# EAGLE design mirrored (EAGLE 9.1.2)
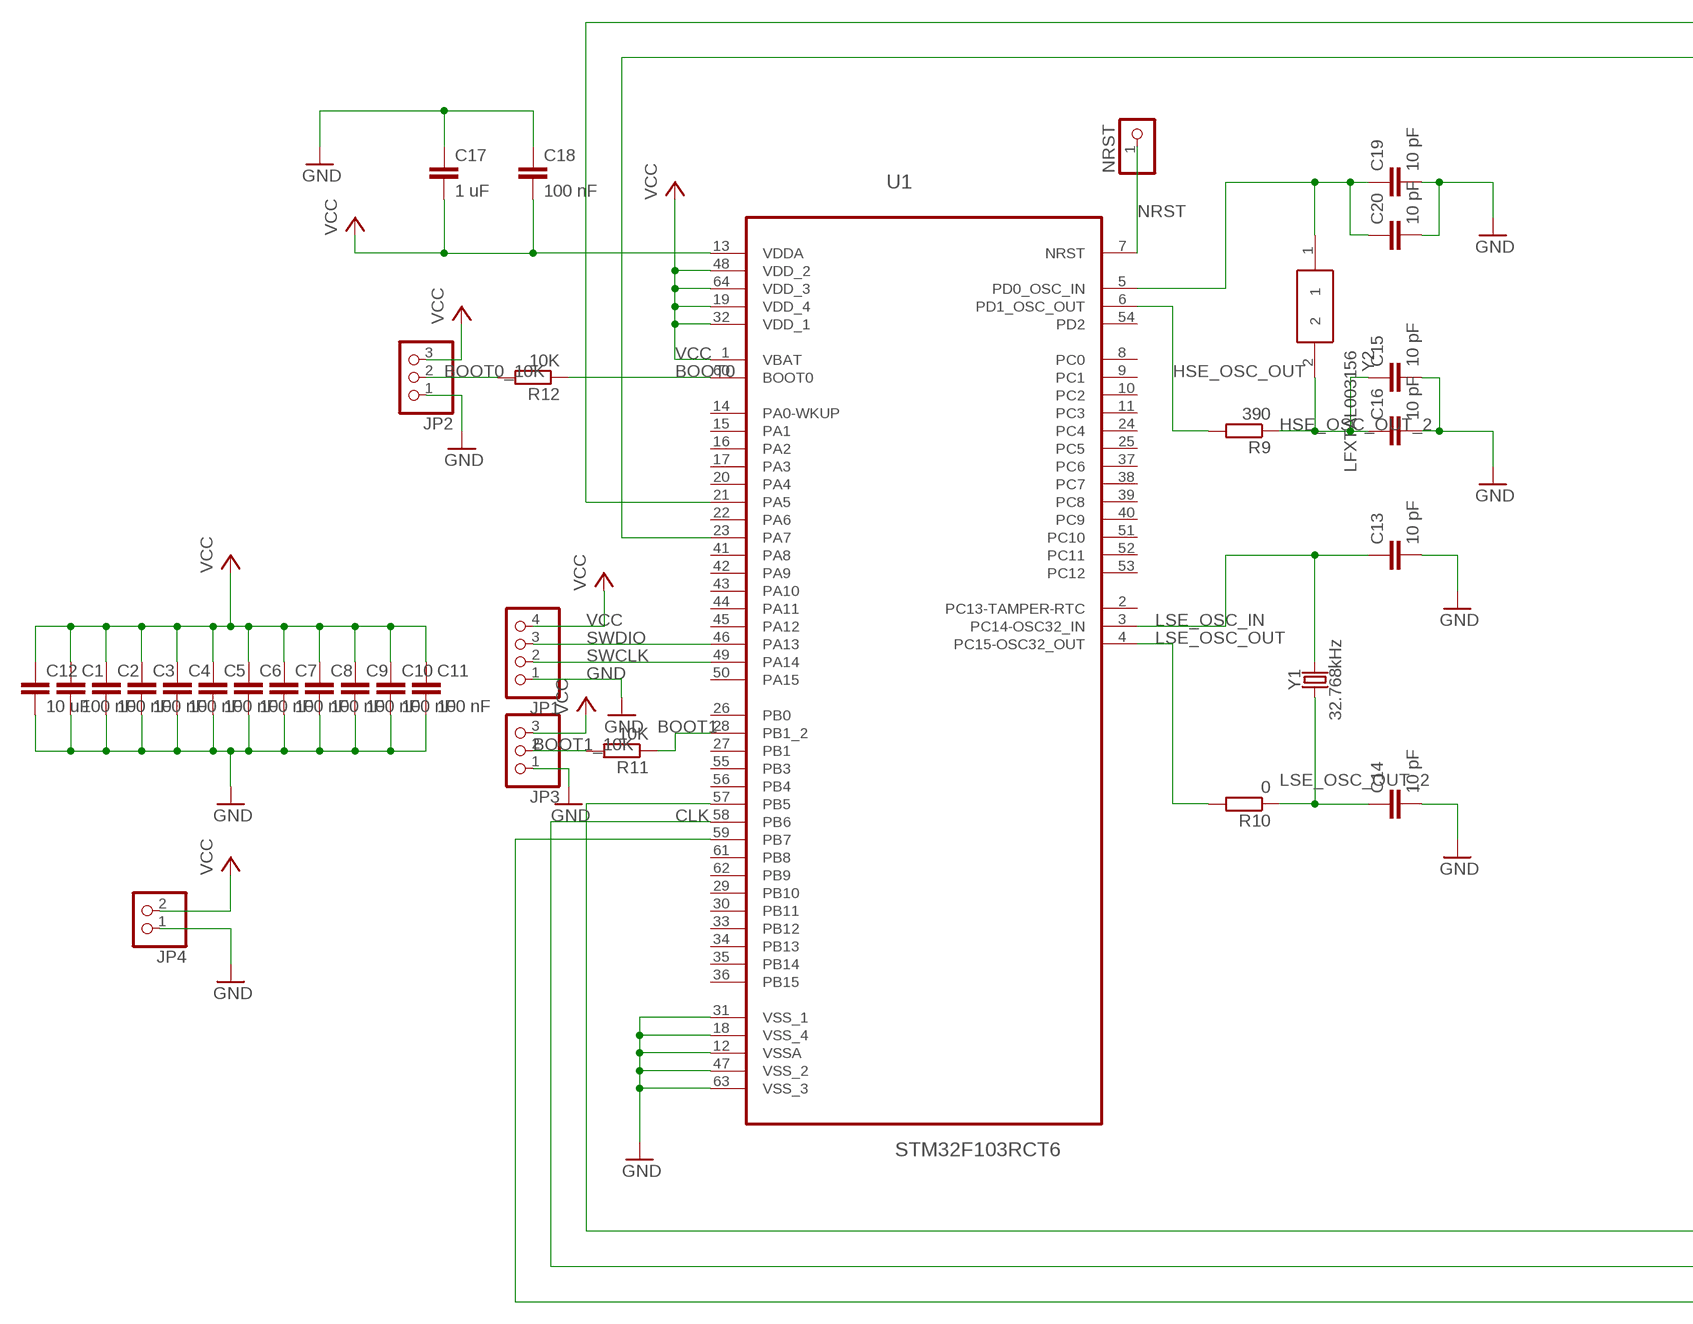
[diagram p0: schematic, sheet 1, part 1 of 2]
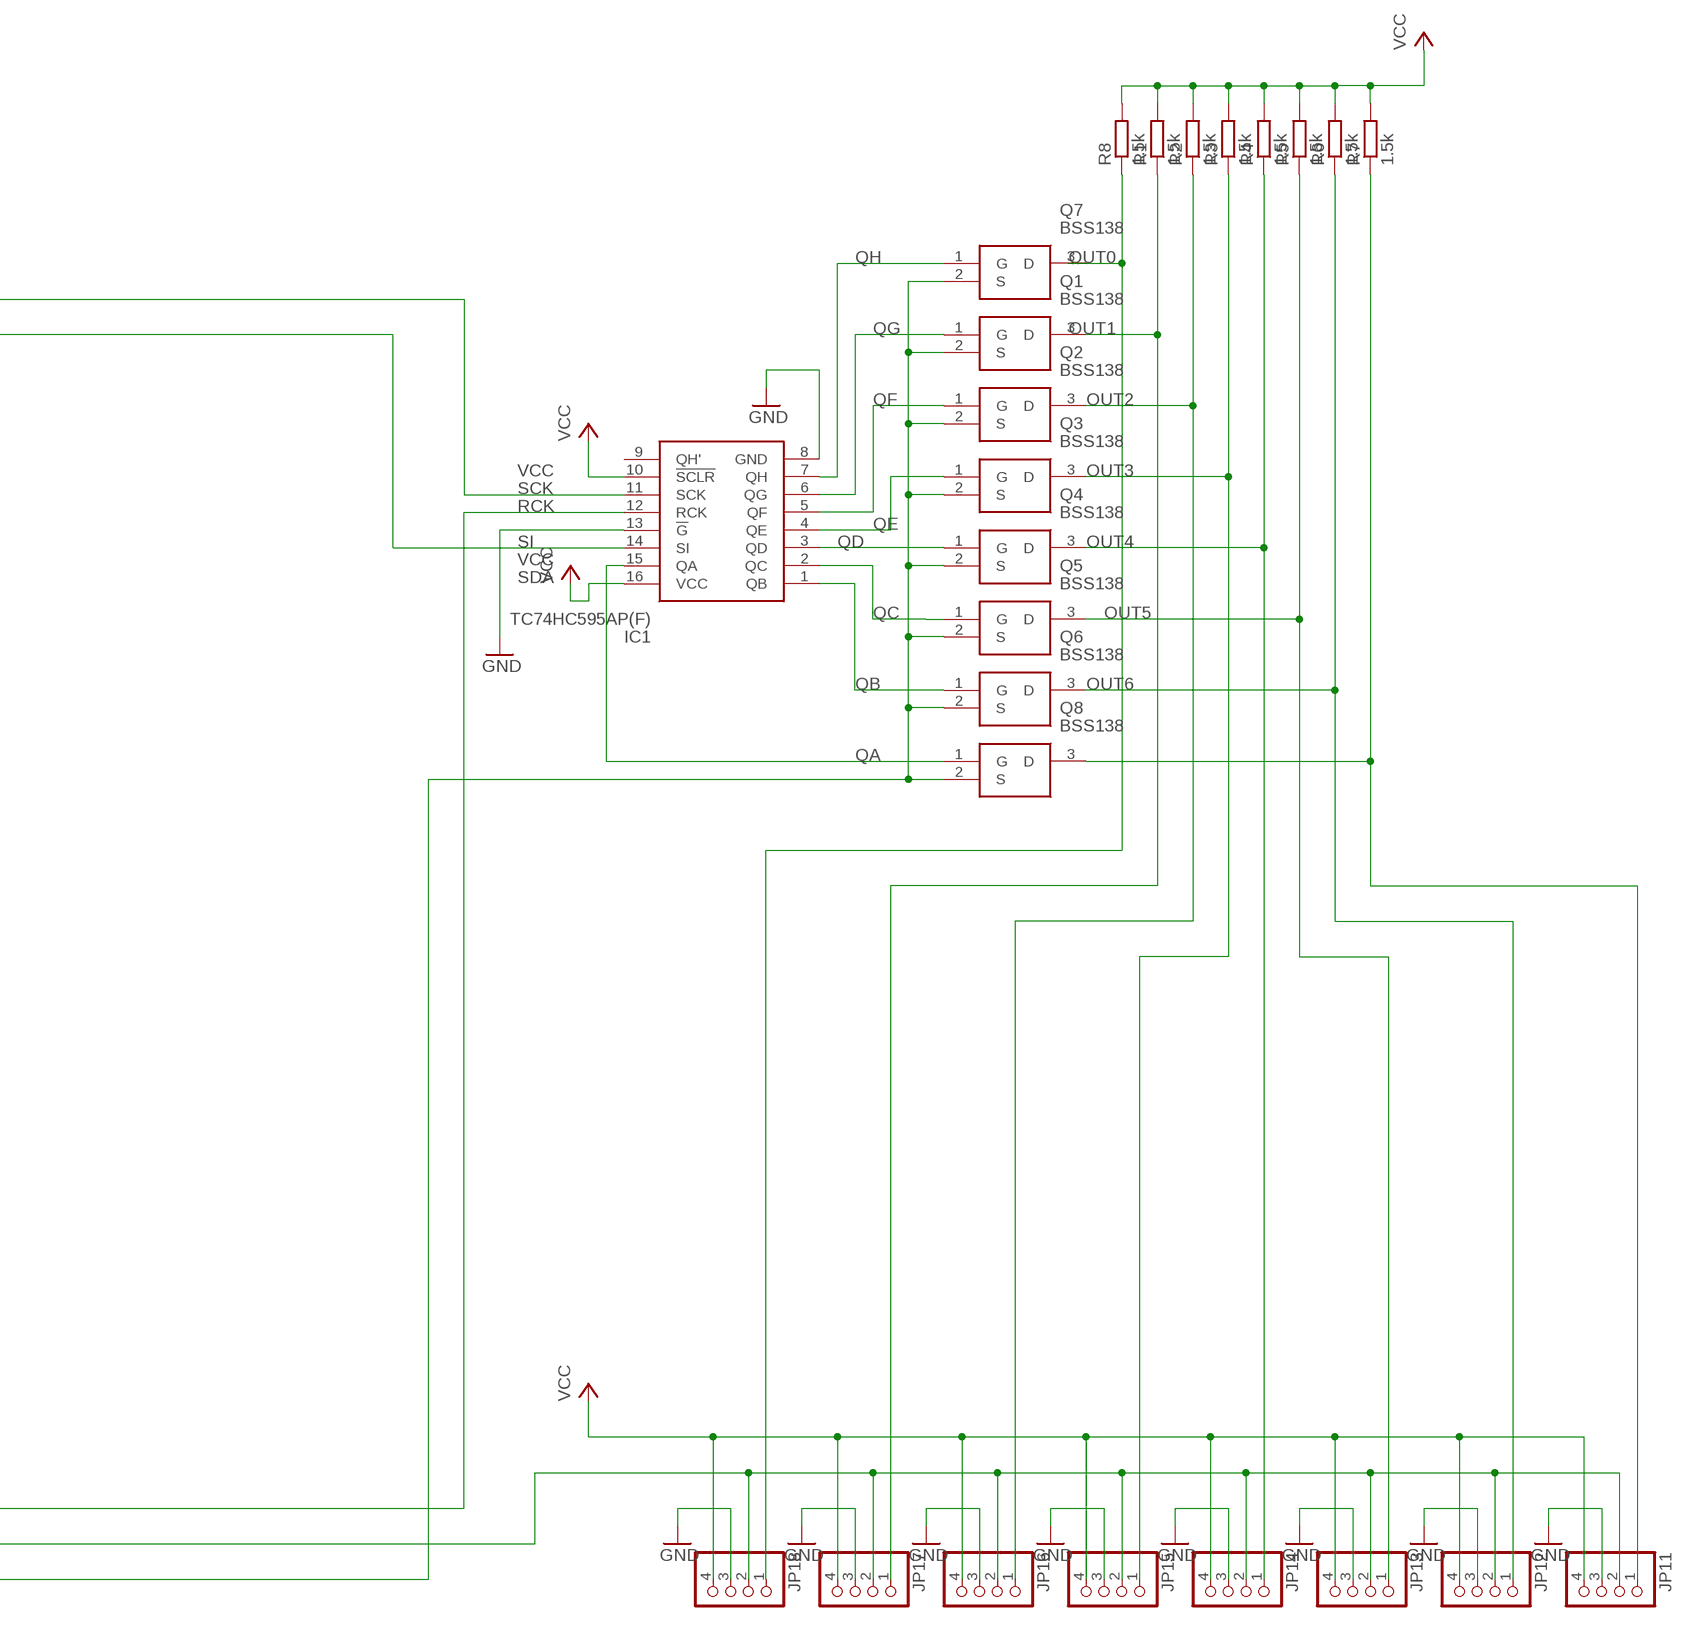
[diagram p1: schematic, sheet 1, part 2 of 2]

## Parts
C1  100 nF  C-EUC0603  [C0603]
C2  100 nF  C-EUC0603  [C0603]
C3  100 nF  C-EUC0603  [C0603]
C4  100 nF  C-EUC0603  [C0603]
C5  100 nF  C-EUC0603  [C0603]
C6  100 nF  C-EUC0603  [C0603]
C7  100 nF  C-EUC0603  [C0603]
C8  100 nF  C-EUC0603  [C0603]
C9  100 nF  C-EUC0603  [C0603]
C10  100 nF  C-EUC0603  [C0603]
C11  100 nF  C-EUC0603  [C0603]
C12  10 uF  C-EUC0603  [C0603]
C13  10 pF  C-EUC0805  [C0805]
C14  10 pF  C-EUC0805  [C0805]
C15  10 pF  C-EUC0805  [C0805]
C16  10 pF  C-EUC0805  [C0805]
C17  1 uF  C-EUC0603  [C0603]
C18  100 nF  C-EUC0603  [C0603]
C19  10 pF  C-EUC0805  [C0805]
C20  10 pF  C-EUC0805  [C0805]
IC1  TC74HC595AP(F)  [DIP762W60P254L1925H445Q16N]
JP1  PINHD-1X4  [1X04]
JP2  PINHD-1X3  [1X03]
JP3  PINHD-1X3  [1X03]
JP4  PINHD-1X2  [1X02]
JP11  PINHD-1X4  [1X04]
JP12  PINHD-1X4  [1X04]
JP13  PINHD-1X4  [1X04]
JP14  PINHD-1X4  [1X04]
JP15  PINHD-1X4  [1X04]
JP16  PINHD-1X4  [1X04]
JP17  PINHD-1X4  [1X04]
JP18  PINHD-1X4  [1X04]
NRST  PINHD-1X1  [1X01]
Q1  BSS138  [SOT95P240X120-3N]
Q2  BSS138  [SOT95P240X120-3N]
Q3  BSS138  [SOT95P240X120-3N]
Q4  BSS138  [SOT95P240X120-3N]
Q5  BSS138  [SOT95P240X120-3N]
Q6  BSS138  [SOT95P240X120-3N]
Q7  BSS138  [SOT95P240X120-3N]
Q8  BSS138  [SOT95P240X120-3N]
R1  1.5k  R-EU_0207/15  [0207/15]
R2  1.5k  R-EU_0207/15  [0207/15]
R3  1.5k  R-EU_0207/15  [0207/15]
R4  1.5k  R-EU_0207/15  [0207/15]
R5  1.5k  R-EU_0207/15  [0207/15]
R6  1.5k  R-EU_0207/15  [0207/15]
R7  1.5k  R-EU_0207/15  [0207/15]
R8  1.5k  R-EU_0207/15  [0207/15]
R9  390  R-EU_0207/15  [0207/15]
R10  0  R-EU_0207/15  [0207/15]
R11  10K  R-EU_0207/15  [0207/15]
R12  10K  R-EU_0207/15  [0207/15]
U1  STM32F103RCT6  [QFP50P1200X1200X160-64N]
Y1  32.768kHz  CRYSTAL-32.768KHZPTH-2X6  [CRYSTAL-PTH-2X6-CYL]
Y2  LFXTAL003156  [IQD-HC-49-4H]

## Nets
BOOT0: R12.1 U1.60(BOOT0)
BOOT0_10K: JP2.2 R12.2
BOOT1: R11.1 U1.28(PB1_2)
BOOT1_10K: JP3.2 R11.2
CLK: JP11.2 JP12.2 JP13.2 JP14.2 JP15.2 JP16.2 JP17.2 JP18.2 U1.58(PB6)
GND: C1.2 C2.2 C3.2 C4.2 C5.2 C6.2 C7.2 C8.2 C9.2 C10.2 C11.2 C12.2 C13.2 C14.2 C15.2 C16.2 C17.1 C18.1 C19.2 C20.2 IC1.8(GND) IC1.13(!G) JP1.1 JP2.1 JP3.1 JP4.1 JP11.3 JP12.3 JP13.3 JP14.3 JP15.3 JP16.3 JP17.3 JP18.3 U1.12(VSSA) U1.18(VSS_4) U1.31(VSS_1) U1.47(VSS_2) U1.63(VSS_3)
HSE_OSC_IN: C19.1 C20.1 U1.5(PD0_OSC_IN) Y2.1
HSE_OSC_OUT: R9.2 U1.6(PD1_OSC_OUT)
HSE_OSC_OUT_2: C15.1 C16.1 R9.1 Y2.2
LSE_OSC_IN: C13.1 U1.3(PC14-OSC32_IN) Y1.2
LSE_OSC_OUT: R10.2 U1.4(PC15-OSC32_OUT)
LSE_OSC_OUT_2: C14.1 R10.1 Y1.1
NRST: NRST.1 U1.7(NRST)
OUT0: JP18.1 Q7.3(D) R8.1
OUT1: JP17.1 Q1.3(D) R1.1
OUT2: JP16.1 Q2.3(D) R2.1
OUT3: JP15.1 Q3.3(D) R3.1
OUT4: JP14.1 Q4.3(D) R4.1
OUT5: JP13.1 Q5.3(D) R5.1
OUT6: JP12.1 Q6.3(D) R6.1
OUT7: JP11.1 Q8.3(D) R7.1
QA: IC1.15(QA) Q8.1(G)
QB: IC1.1(QB) Q6.1(G)
QC: IC1.2(QC) Q5.1(G)
QD: IC1.3(QD) Q4.1(G)
QE: IC1.4(QE) Q3.1(G)
QF: IC1.5(QF) Q2.1(G)
QG: IC1.6(QG) Q1.1(G)
QH: IC1.7(QH) Q7.1(G)
RCK: IC1.12(RCK) U1.57(PB5)
SCK: IC1.11(SCK) U1.21(PA5)
SDA: Q1.2(S) Q2.2(S) Q3.2(S) Q4.2(S) Q5.2(S) Q6.2(S) Q7.2(S) Q8.2(S) U1.59(PB7)
SI: IC1.14(SI) U1.23(PA7)
SWCLK: JP1.2 U1.49(PA14)
SWDIO: JP1.3 U1.46(PA13)
VCC: C1.1 C2.1 C3.1 C4.1 C5.1 C6.1 C7.1 C8.1 C9.1 C10.1 C11.1 C12.1 C17.2 C18.2 IC1.10(!SCLR) IC1.16(VCC) JP1.4 JP2.3 JP3.3 JP4.2 JP11.4 JP12.4 JP13.4 JP14.4 JP15.4 JP16.4 JP17.4 JP18.4 R1.2 R2.2 R3.2 R4.2 R5.2 R6.2 R7.2 R8.2 U1.1(VBAT) U1.13(VDDA) U1.19(VDD_4) U1.32(VDD_1) U1.48(VDD_2) U1.64(VDD_3)
Unconnected: IC1.9(QH') U1.2(PC13-TAMPER-RTC) U1.8(PC0) U1.9(PC1) U1.10(PC2) U1.11(PC3) U1.14(PA0-WKUP) U1.15(PA1) U1.16(PA2) U1.17(PA3) U1.20(PA4) U1.22(PA6) U1.24(PC4) U1.25(PC5) U1.26(PB0) U1.27(PB1) U1.29(PB10) U1.30(PB11) U1.33(PB12) U1.34(PB13) U1.35(PB14) U1.36(PB15) U1.37(PC6) U1.38(PC7) U1.39(PC8) U1.40(PC9) U1.41(PA8) U1.42(PA9) U1.43(PA10) U1.44(PA11) U1.45(PA12) U1.50(PA15) U1.51(PC10) U1.52(PC11) U1.53(PC12) U1.54(PD2) U1.55(PB3) U1.56(PB4) U1.61(PB8) U1.62(PB9)

## Library data of the parts
C1-C11 C17 C18 = rcl:C-EU: CAPACITOR, European symbol; SPICEPREFIX: C
C12-C16 C19 C20 = resistor:C-EU: CAPACITOR, European symbol
IC1 = TC74HC595AP(F):TC74HC595AP(F): IC,CMOS logic,DIP16,SHIFT REGISTERS Source: Datasheet <http://toshiba.semicon-storage.com/info/docget.jsp?did=16512&prodName=TC74HC595AP>; DESCRIPTION: IC,CMOS logic,DIP16,SHIFT REGISTERS; HEIGHT: 4.45mm; MANUFACTURER_NAME: Toshiba; MANUFACTURER_PART_NUMBER: TC74HC595AP(F); MOUSER_PART_NUMBER: N/A; MOUSER_PRICE-STOCK: https://www.mouser.com/Search/Refine.aspx?Keyword=N%2FA; RS_PART_NUMBER: 5400095P; RS_PRICE-STOCK: http://au.rs-online.com/web/p/products/5400095P
JP1 JP11-JP18 = pinhead:PINHD-1X4: PIN HEADER
JP2 JP3 = pinhead:PINHD-1X3: PIN HEADER
JP4 = pinhead:PINHD-1X2: PIN HEADER
NRST = pinhead:PINHD-1X1: PIN HEADER
Q1-Q8 = BSS138:BSS138: N-channel MOSFET,BSS138 0.2A 50V Source: Datasheet <https://www.onsemi.com/pub/Collateral/BSS138-D.PDF>; DESCRIPTION: N-channel MOSFET,BSS138 0.2A 50V; HEIGHT: 1.2mm; MANUFACTURER_NAME: ON Semiconductor; MANUFACTURER_PART_NUMBER: BSS138; MOUSER_PART_NUMBER: 512-BSS138; RS_PART_NUMBER: 1241694; RS_PRICE-STOCK: http://uk.rs-online.com/web/p/products/1241694
R1-R12 = rcl:R-EU_: RESISTOR, European symbol; SPICEPREFIX: R
U1 = STM32F103RCT6:STM32F103RCT6: ARM-based 32-bit MCU; AVAILABILITY: Unavailable; DESCRIPTION: Mainstream Performance line, ARM Cortex-M3 MCU with 256 Kbytes Flash, 72 MHz CPU, motor control, USB and CAN; MF: STMicroelectronics; MP: STM32F103RCT6; PACKAGE: LQFP-64 STMicroelectronics; PRICE: None
Y1 = SparkFun-Clocks:CRYSTAL-32.768KHZ: 32.768kHz Crystal Frequency: 32.768kHz Frequency Stability: ±20ppm Load Capacitance: 12.5pF (PTH-2X6 & SMD-3.2X1.5), 6pF (SMD-2X6) SparkFun Products: SparkFun BigTime Watch Kit <https://www.sparkfun.com/products/11734> SparkFun nRF52832 Breakout <https://www.sparkfun.com/products/13990> SparkFun Real Time Clock Module <https://www.sparkfun.com/products/12708>; PROD_ID: XTAL-10112
Y2 = LFXTAL003156:LFXTAL003156: Crystal,8.0000MHz,30ppm,30pF,HC49/4H,XTAL003156 8MHZ Source: Datasheet <https://docs-emea.rs-online.com/webdocs/00af/0900766b800afdaf.pdf>; ALLIED_NUMBER: R1047051; ALLIED_PRICE-STOCK: https://www.alliedelec.com/iqd-frequency-products-lfxtal003156/R1047051/; DESCRIPTION: Crystal,8.0000MHz,30ppm,30pF,HC49/4H,XTAL003156 8MHZ; HEIGHT: mm; MANUFACTURER_NAME: IQD; MANUFACTURER_PART_NUMBER: LFXTAL003156; RS_PART_NUMBER: 1533666; RS_PRICE-STOCK: http://uk.rs-online.com/web/p/products/1533666

## Net classes
0 default: clearance 0.25 mm

## Board
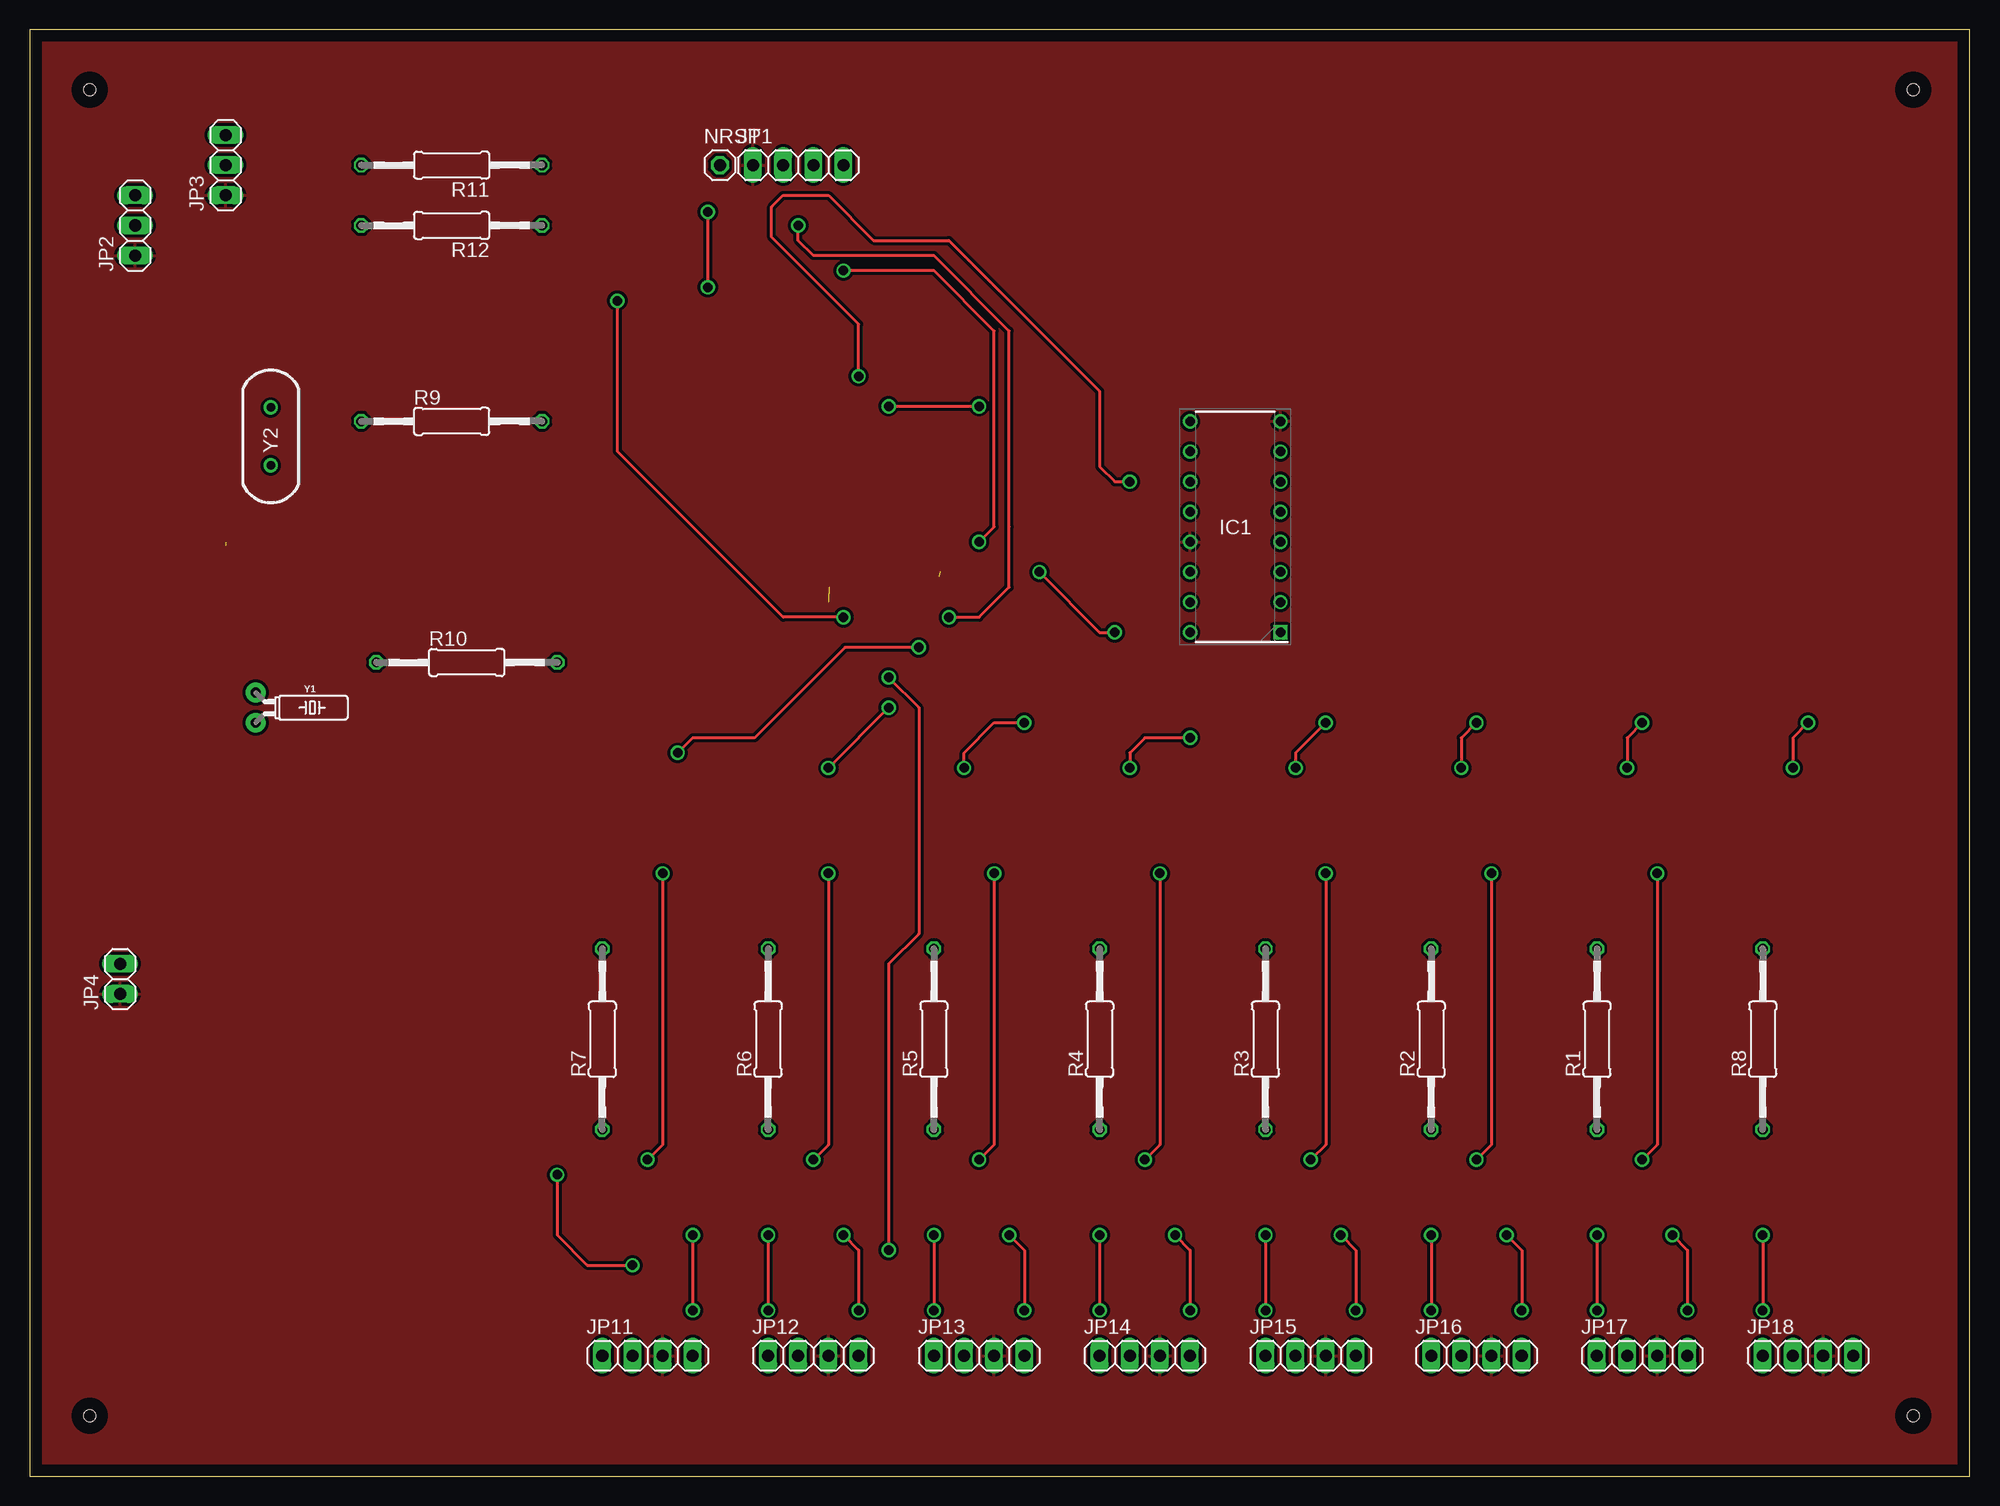
[diagram p2: board, top side]
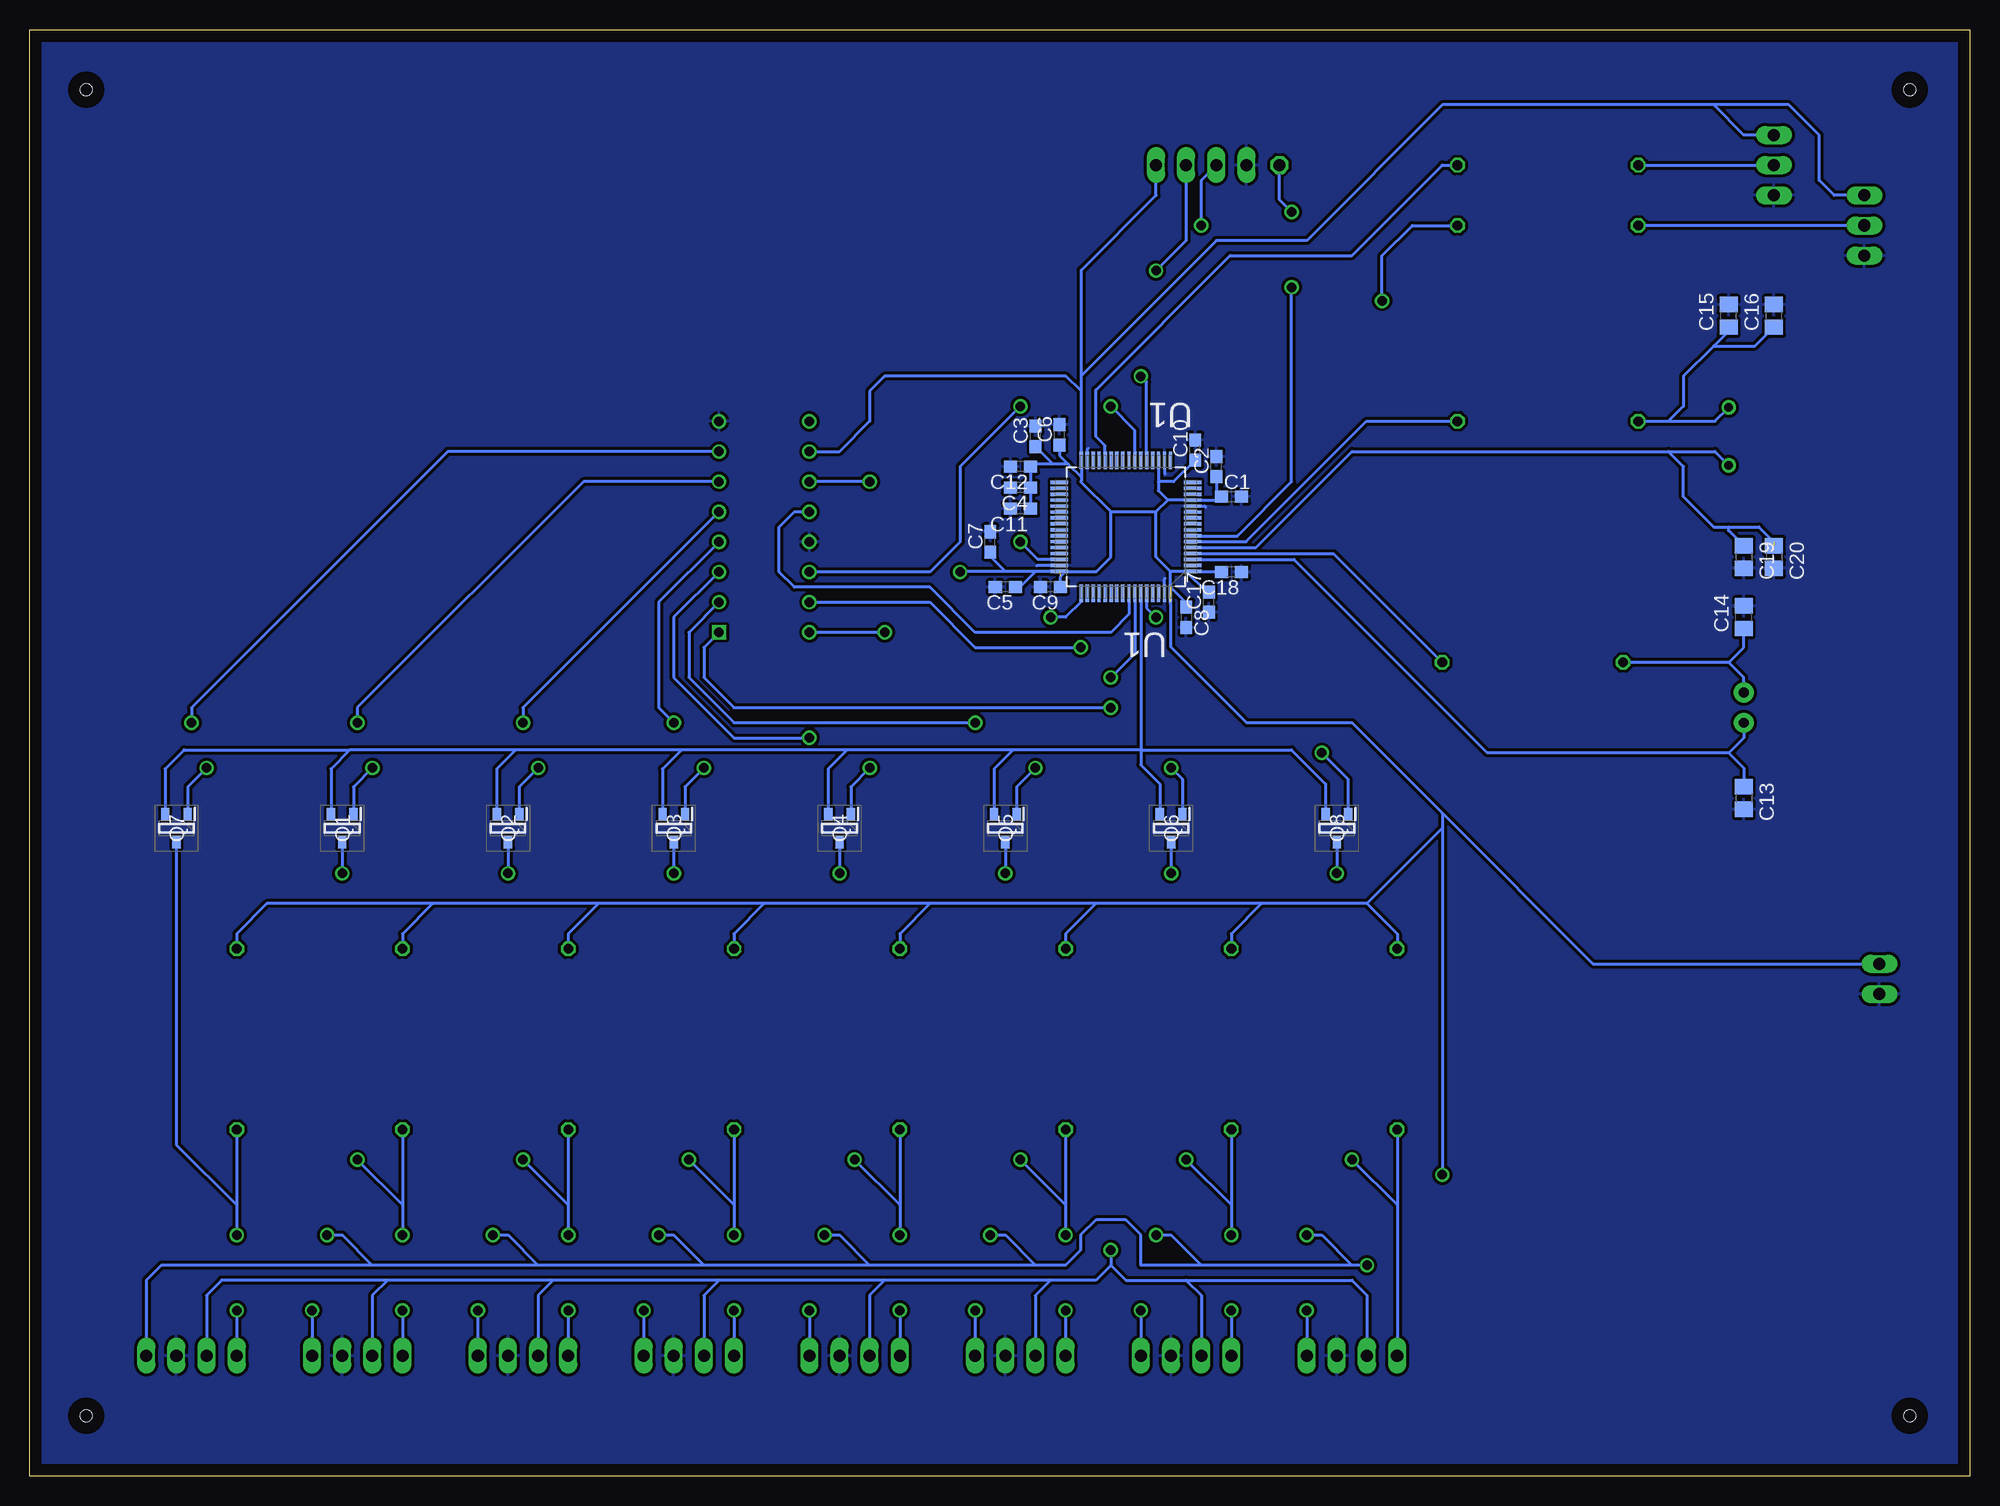
[diagram p3: board, bottom side, seen from below]

Size 163.5 x 121.91 mm. Coordinates in mm from the lower left corner, seen from the top.
Outline: 0,0 163.5,0 163.5,121.91 0,121.91 0,0
Copper layers (1*16): Top 0.035mm / dielectric 1.5mm / Bottom 0.035mm
Design rules "untitled": minimum track width 6mil, minimum drill 0.35mm, track to track 6mil, track to pad 0.152mm, pad to pad 0.152mm, via to via 0.152mm, smd to smd 0.05mm, copper to edge 40mil, drill to drill 6mil, minimum pad ring 0.15mm, minimum via ring 0.15mm, stop-mask expansion 4mil, vias tented up to drill 0mil, thermal gap 10mil
Holes 1 mm at 5.08,116.84 5.08,5.08 158.75,5.08 158.75,116.84

### Footprints (pad centres in the part's own frame; a part is rotated, then mirrored left to right if it is on the bottom)
C0603 = smd 1.1 x 1: 1 -0.85,0; 2 0.85,0
C0805 = smd 1.3 x 1.5: 1 -0.95,0; 2 0.95,0
DIP762W60P254L1925H445Q16N = drill 0.8 pad 1.2 square: 1 -3.81,8.89 | drill 0.8 pad 1.2: 2 -3.81,6.35; 3 -3.81,3.81; 4 -3.81,1.27; 5 -3.81,-1.27; 6 -3.81,-3.81; 7 -3.81,-6.35; 8 -3.81,-8.89; 9 3.81,-8.89; 10 3.81,-6.35; 11 3.81,-3.81; 12 3.81,-1.27; 13 3.81,1.27; 14 3.81,3.81; 15 3.81,6.35; 16 3.81,8.89
1X04 = drill 1.016 long: 1 -3.81,0; 2 -1.27,0; 3 1.27,0; 4 3.81,0
1X03 = drill 1.016 long: 1 -2.54,0; 2 0,0; 3 2.54,0
1X02 = drill 1.016 long: 1 -1.27,0; 2 1.27,0
1X01 = drill 1.016 octagon: 1 0,0
SOT95P240X120-3N = smd 1 x 0.7: 1 -1.2,0.95; 2 -1.2,-0.95; 3 1.2,0
0207/15 = drill 0.813 octagon: 1 -7.62,0; 2 7.62,0
QFP50P1200X1200X160-64N = smd 1.473 x 0.279: 1 -5.613,3.759; 2 -5.613,3.251; 3 -5.613,2.743; 4 -5.613,2.261; 5 -5.613,1.753; 6 -5.613,1.245; 7 -5.613,0.762; 8 -5.613,0.254; 9 -5.613,-0.254; 10 -5.613,-0.762; 11 -5.613,-1.245; 12 -5.613,-1.753; 13 -5.613,-2.261; 14 -5.613,-2.743; 15 -5.613,-3.251; 16 -5.613,-3.759; 33 5.613,-3.759; 34 5.613,-3.251; 35 5.613,-2.743; 36 5.613,-2.261; 37 5.613,-1.753; 38 5.613,-1.245; 39 5.613,-0.762; 40 5.613,-0.254; 41 5.613,0.254; 42 5.613,0.762; 43 5.613,1.245; 44 5.613,1.753; 45 5.613,2.261; 46 5.613,2.743; 47 5.613,3.251; 48 5.613,3.759 | smd 0.279 x 1.473: 17 -3.759,-5.613; 18 -3.251,-5.613; 19 -2.743,-5.613; 20 -2.261,-5.613; 21 -1.753,-5.613; 22 -1.245,-5.613; 23 -0.762,-5.613; 24 -0.254,-5.613; 25 0.254,-5.613; 26 0.762,-5.613; 27 1.245,-5.613; 28 1.753,-5.613; 29 2.261,-5.613; 30 2.743,-5.613; 31 3.251,-5.613; 32 3.759,-5.613; 49 3.759,5.613; 50 3.251,5.613; 51 2.743,5.613; 52 2.261,5.613; 53 1.753,5.613; 54 1.245,5.613; 55 0.762,5.613; 56 0.254,5.613; 57 -0.254,5.613; 58 -0.762,5.613; 59 -1.245,5.613; 60 -1.753,5.613; 61 -2.261,5.613; 62 -2.743,5.613; 63 -3.251,5.613; 64 -3.759,5.613
CRYSTAL-PTH-2X6-CYL = drill 0.813 pad 1.676: 1 -1.27,0; 2 1.27,0
IQD-HC-49-4H = drill 0.7 pad 1.2: 1 -2.44,0; 2 2.44,0

### Placement (x,y rotation side)
C1  62.23,82.55 0 bottom
C2  63.5,85.09 90 bottom
C3  78.74,87.63 90 bottom
C4  80.01,83.31 180 bottom
C5  81.28,74.93 180 bottom
C6  76.71,87.76 90 bottom
C7  82.55,78.74 90 bottom
C8  66.04,72.39 270 bottom
C9  77.47,74.93 180 bottom
C10  65.28,86.49 90 bottom
C11  80.01,81.53 180 bottom
C12  80.01,85.09 180 bottom
C13  19.05,57.15 270 bottom
C14  19.05,72.39 90 bottom
C15  20.32,97.79 90 bottom
C16  16.51,97.79 90 bottom
C17  64.13,73.66 90 bottom
C18  62.23,76.2 180 bottom
C19  19.05,77.47 270 bottom
C20  16.51,77.47 270 bottom
IC1  101.6,80.01 180 top
JP1  64.77,110.49 0 top
JP2  8.89,105.41 90 top
JP3  16.51,110.49 90 top
JP4  7.62,41.91 90 top
JP11  52.07,10.16 0 top
JP12  66.04,10.16 0 top
JP13  80.01,10.16 0 top
JP14  93.98,10.16 0 top
JP15  107.95,10.16 0 top
JP16  121.92,10.16 0 top
JP17  135.89,10.16 0 top
JP18  149.86,10.16 0 top
NRST  58.17,110.49 0 top
Q1  137.16,54.61 270 bottom
Q2  123.19,54.61 270 bottom
Q3  109.22,54.61 270 bottom
Q4  95.25,54.61 270 bottom
Q5  81.28,54.61 270 bottom
Q6  67.31,54.61 270 bottom
Q7  151.13,54.61 270 bottom
Q8  53.34,54.61 270 bottom
R1  132.08,36.83 90 top
R2  118.11,36.83 90 top
R3  104.14,36.83 90 top
R4  90.17,36.83 90 top
R5  76.2,36.83 90 top
R6  62.23,36.83 90 top
R7  48.26,36.83 90 top
R8  146.05,36.83 90 top
R9  35.56,88.9 0 top
R10  36.83,68.58 0 top
R11  35.56,110.49 180 top
R12  35.56,105.41 180 top
U1  71.12,80.01 180 bottom
Y1  19.05,64.77 270 top
Y2  20.32,87.63 90 top

### Tracks (layer width: path | path; a pad name or v marks a point on that pad's centre or on a via)
BOOT0  (via drill 0.8)
  Top 0.254: v68.58,72.39 63.5,72.39 49.53,86.36 v49.53,99.06
  Bottom 0.254: U1.60 69.37,73.18 v68.58,72.39 | v49.53,99.06 49.53,102.87 46.99,105.41 R12.1
BOOT0_10K
  Bottom 0.254: JP2.2 R12.2
BOOT1
  Bottom 0.254: U1.28 72.87,86.84 73.66,87.63 73.66,91.55 62.34,102.87 52.07,102.87 44.45,110.49 R11.1
BOOT1_10K
  Bottom 0.254: R11.2 JP3.2
CLK  (via drill 0.8)
  Top 0.254: v72.39,67.31 74.93,64.77 74.93,45.72 72.39,43.18 v72.39,19.05
  Bottom 0.254: U1.58 70.36,69.34 v72.39,67.31 | 66.04,16.51 71.12,16.51 72.39,17.78 | JP12.2 64.77,15.24 66.04,16.51 | 66.04,16.51 52.07,16.51 50.8,15.24 JP11.2 | 77.47,16.51 73.66,16.51 72.39,17.78 | 77.47,16.51 78.74,15.24 JP13.2 | 77.47,16.51 91.44,16.51 | 91.44,16.51 92.71,15.24 JP14.2 | 105.41,16.51 106.68,15.24 JP15.2 | 91.44,16.51 105.41,16.51 | 105.41,16.51 119.38,16.51 | 119.38,16.51 120.65,15.24 JP16.2 | 119.38,16.51 133.35,16.51 | 133.35,16.51 134.62,15.24 JP17.2 | 133.35,16.51 147.32,16.51 148.59,15.24 JP18.2 | v72.39,19.05 72.39,17.78
GND
  Bottom 0.254: U1.47 78.56,76.76 78.61,76.71 | U1.31 74.37,86.54 74.3,86.61 | U1.18 67.87,84.51 67.82,84.45 | U1.12 64.49,81.76 64.39,81.66 | U1.63 67.87,75.64 67.82,75.69
  pour Top: -35.56,165.1 -35.56,-3.3 6.86,-45.72 173.99,-45.72 218.44,-1.27 218.44,130.81 179.07,170.18 -30.48,170.18
  pour Bottom: -25.4,162.56 -34.61,153.35 -34.61,2.86 43.18,-74.93 180.34,-74.93 256.54,1.27 256.54,158.75 229.87,185.42 -2.54,185.42
HSE_OSC_IN  (1 unrouted)
  Bottom 0.254: U1.5 60.17,78.26 52.07,86.36 25.4,86.36 | Y2.1 21.49,86.36 25.4,86.36 | 25.4,86.36 24.13,85.09 24.13,82.55 21.59,80.01 20.32,80.01 | 16.51,78.74 17.78,80.01 20.32,80.01 | C19.1 20.32,79.69 20.32,80.01
HSE_OSC_OUT
  Bottom 0.254: U1.6 60.98,78.76 50.85,88.9 R9.2
HSE_OSC_OUT_2
  Bottom 0.254: Y2.2 21.49,88.9 25.4,88.9 | R9.1 25.4,88.9 | 25.4,88.9 24.13,90.17 24.13,92.71 21.59,95.25 | C16.1 18.1,95.25 21.59,95.25 | 21.59,95.25 20.32,96.52 C15.1
LSE_OSC_IN
  Bottom 0.254: U1.3 56.95,77.27 40.64,60.96 20.32,60.96 | Y1.2 19.05,62.23 20.32,60.96 | 20.32,60.96 19.05,59.69 C13.1
LSE_OSC_OUT
  Bottom 0.254: U1.4 53.62,77.75 R10.2
LSE_OSC_OUT_2
  Bottom 0.254: Y1.1 19.05,67.31 20.32,68.58 | 20.32,68.58 19.05,69.85 C14.1 | 20.32,68.58 R10.1
NRST  (via drill 0.8)
  Top 0.254: v57.15,100.2 v57.15,106.55
  Bottom 0.254: U1.7 61.72,79.25 57.15,83.82 v57.15,100.2 | v57.15,106.55 58.17,107.57 NRST.1
OUT0  (via drill 0.8)
  Top 0.254: v146.05,20.32 v146.05,13.97
  Bottom 0.254: R8.1 146.05,22.86 | 146.05,22.86 v146.05,20.32 | v146.05,13.97 JP18.1 | Q7.3 151.13,27.94 146.05,22.86
OUT1  (via drill 0.8)
  Top 0.254: v132.08,20.32 v132.08,13.97 | v137.16,50.8 137.16,27.94 v135.89,26.67
  Bottom 0.254: R1.1 132.08,22.86 | 132.08,22.86 v132.08,20.32 | v132.08,13.97 JP17.1 | Q1.3 v137.16,50.8 | v135.89,26.67 132.08,22.86
OUT2  (via drill 0.8)
  Top 0.254: v118.11,20.32 v118.11,13.97 | v123.19,50.8 123.19,27.94 v121.92,26.67
  Bottom 0.254: R2.1 118.11,22.86 | 118.11,22.86 v118.11,20.32 | v118.11,13.97 JP16.1 | Q2.3 v123.19,50.8 | v121.92,26.67 118.11,22.86
OUT3  (via drill 0.8)
  Top 0.254: v104.14,20.32 v104.14,13.97 | v109.22,50.8 109.22,27.94 v107.95,26.67
  Bottom 0.254: R3.1 104.14,22.86 | 104.14,22.86 v104.14,20.32 | v104.14,13.97 JP15.1 | Q3.3 v109.22,50.8 | v107.95,26.67 104.14,22.86
OUT4  (via drill 0.8)
  Top 0.254: v90.17,20.32 v90.17,13.97 | v95.25,50.8 95.25,27.94 v93.98,26.67
  Bottom 0.254: R4.1 90.17,22.86 | 90.17,22.86 v90.17,20.32 | v90.17,13.97 JP14.1 | Q4.3 v95.25,50.8 | v93.98,26.67 90.17,22.86
OUT5  (via drill 0.8)
  Top 0.254: v76.2,20.32 v76.2,13.97 | v81.28,50.8 81.28,27.94 v80.01,26.67
  Bottom 0.254: R5.1 76.2,22.86 | 76.2,22.86 v76.2,20.32 | v76.2,13.97 JP13.1 | Q5.3 v81.28,50.8 | v80.01,26.67 76.2,22.86
OUT6  (via drill 0.8)
  Top 0.254: v62.23,20.32 v62.23,13.97 | v67.31,50.8 67.31,27.94 v66.04,26.67
  Bottom 0.254: R6.1 62.23,22.86 | 62.23,22.86 v62.23,20.32 | v62.23,13.97 JP12.1 | Q6.3 v67.31,50.8 | v66.04,26.67 62.23,22.86
OUT7  (via drill 0.8)
  Top 0.254: v53.34,50.8 53.34,27.94 v52.07,26.67
  Bottom 0.254: R7.1 48.26,22.86 | 48.26,22.86 JP11.1 | Q8.3 v53.34,50.8 | v52.07,26.67 48.26,22.86
QA  (via drill 0.8)
  Top 0.254: v74.93,69.85 68.7,69.85 61.09,62.23 55.88,62.23 v54.61,60.96
  Bottom 0.254: IC1.15 87.63,73.66 83.82,69.85 v74.93,69.85 | v54.61,60.96 52.39,58.74 Q8.1
QB  (via drill 0.8)
  Top 0.254: v72.39,64.77 v67.31,59.69
  Bottom 0.254: IC1.1 106.68,69.85 106.68,67.31 104.14,64.77 v72.39,64.77 | Q6.1 66.36,58.74 v67.31,59.69
QC  (via drill 0.8)
  Top 0.254: v78.74,59.69 78.74,60.96 81.28,63.5 v83.82,63.5
  Bottom 0.254: IC1.2 107.95,71.12 107.95,67.31 104.14,63.5 v83.82,63.5 | v78.74,59.69 80.33,58.1 Q5.1
QD  (via drill 0.8)
  Top 0.254: v92.71,59.69 92.71,60.96 93.98,62.23 v97.79,62.23
  Bottom 0.254: IC1.3 109.22,72.39 109.22,67.31 104.14,62.23 v97.79,62.23 | Q4.1 94.3,58.1 v92.71,59.69
QE  (via drill 0.8)
  Top 0.254: v109.22,63.5 106.68,60.96 v106.68,59.69
  Bottom 0.254: IC1.4 110.49,73.66 110.49,64.77 v109.22,63.5 | Q3.1 108.27,58.1 v106.68,59.69
QF  (via drill 0.8)
  Top 0.254: v121.92,63.5 120.65,62.23 v120.65,59.69
  Bottom 0.254: IC1.5 121.92,64.77 v121.92,63.5 | v120.65,59.69 122.24,58.1 Q2.1
QG  (via drill 0.8)
  Top 0.254: v135.89,63.5 134.62,62.23 v134.62,59.69
  Bottom 0.254: v135.89,63.5 135.89,64.77 116.84,83.82 IC1.6 | v134.62,59.69 136.21,58.1 Q1.1
QH  (via drill 0.8)
  Top 0.254: v149.86,63.5 148.59,62.23 v148.59,59.69
  Bottom 0.254: IC1.7 128.27,86.36 149.86,64.77 v149.86,63.5 | v148.59,59.69 150.18,58.1 Q7.1
RCK
  Bottom 0.254: U1.57 70.87,72.64 72.39,71.12 83.82,71.12 87.63,74.93 99.06,74.93 100.33,76.2 100.33,80.01 99.06,81.28 IC1.12
SCK  (via drill 0.8)
  Top 0.254: v69.85,92.71 69.85,97.08 62.52,104.4 62.52,106.97 63.5,107.95 67.31,107.95 71.12,104.14 77.47,104.14 90.17,91.44 90.17,85.09 91.44,83.82 v92.71,83.82
  Bottom 0.254: U1.21 69.37,92.23 v69.85,92.71 | v92.71,83.82 IC1.11
SDA
  Bottom 0.254: U1.59 69.85,74.37 69.85,61.21 | 69.85,61.21 80.64,61.21 | 80.64,61.21 82.23,59.62 Q5.2 | Q6.2 68.26,58.35 69.85,59.94 69.85,61.21 | 80.64,61.21 94.61,61.21 | Q4.2 96.2,59.62 94.61,61.21 | 94.61,61.21 108.58,61.21 | 108.58,61.21 110.17,59.62 Q3.2 | 108.58,61.21 122.55,61.21 | 122.55,61.21 135.89,61.21 136.52,61.21 | Q2.2 124.14,59.62 122.55,61.21 | Q7.2 152.08,59.62 150.49,61.21 136.52,61.21 | 69.85,61.21 57.15,61.21 54.29,58.35 Q8.2 | 136.52,61.21 138.11,59.62 Q1.2
SI  (via drill 0.8)
  Top 0.254: v72.39,90.17 v80.01,90.17
  Bottom 0.254: U1.23 70.36,88.14 v72.39,90.17 | v80.01,90.17 85.09,85.09 85.09,78.74 87.63,76.2 IC1.14
SWCLK  (via drill 0.8)
  Top 0.254: v77.47,72.39 80.01,72.39 82.55,74.93 82.55,80.01 | 82.55,80.01 82.55,96.52 76.2,102.87 66.04,102.87 64.77,104.14 v64.77,105.41 | 82.55,80.01
  Bottom 0.254: U1.49 74.88,73.71 76.2,72.39 v77.47,72.39 | v64.77,105.41 64.77,109.22 JP1.2
SWDIO  (via drill 0.8)
  Top 0.254: v68.58,101.6 76.2,101.6 81.28,96.52 81.28,80.01 v80.01,78.74
  Bottom 0.254: U1.46 78.54,77.27 v80.01,78.74 | v68.58,101.6 66.04,104.14 JP1.3
VCC  (via drill 0.8)  (3 unrouted)
  Top 0.254: v55.88,20.32 v55.88,13.97 | v69.85,13.97 69.85,19.05 v68.58,20.32 | v83.82,13.97 83.82,19.05 v82.55,20.32 | v97.79,13.97 97.79,19.05 v96.52,20.32 | v125.73,13.97 125.73,19.05 v124.46,20.32 | v111.76,13.97 111.76,19.05 v110.49,20.32 | v44.45,25.4 44.45,20.32 46.99,17.78 v50.8,17.78 | v139.7,13.97 139.7,19.05 v138.43,20.32 | v85.09,76.2 90.17,71.12 v91.44,71.12
  Bottom 0.254: JP18.4 153.67,16.51 152.4,17.78 134.62,17.78 | v139.7,13.97 JP17.4 | v125.73,13.97 JP16.4 | v111.76,13.97 JP15.4 | v97.79,13.97 JP14.4 | v83.82,13.97 JP13.4 | v69.85,13.97 JP12.4 | v55.88,13.97 JP11.4 | 44.45,55.88 52.07,63.5 60.96,63.5 67.36,69.9 67.36,73.5 67.35,73.5 67.35,73.66 | 59.69,48.26 62.23,45.72 R6.2 | 59.69,48.26 73.66,48.26 | 73.66,48.26 76.2,45.72 R5.2 | 73.66,48.26 87.63,48.26 | 87.63,48.26 90.17,45.72 R4.2 | 87.63,48.26 101.6,48.26 | 101.6,48.26 104.14,45.72 R3.2 | 101.6,48.26 115.57,48.26 | 115.57,48.26 118.11,45.72 R2.2 | 115.57,48.26 129.54,48.26 | 129.54,48.26 132.08,45.72 R1.2 | R8.2 146.05,45.72 143.51,48.26 129.54,48.26 | 50.8,48.26 59.69,48.26 | 50.8,48.26 48.26,45.72 R7.2 | 44.45,54.61 50.8,48.26 | 44.45,55.88 44.45,54.61 | v50.8,17.78 52.07,17.78 | 52.07,17.78 64.77,17.78 | 64.77,17.78 69.85,17.78 69.85,20.32 71.12,21.59 73.66,21.59 74.93,20.32 74.93,19.05 76.2,17.78 78.74,17.78 | 78.74,17.78 92.71,17.78 | 106.68,17.78 120.65,17.78 | 120.65,17.78 134.62,17.78 | IC1.10 95.25,86.36 92.71,88.9 92.71,91.44 91.44,92.71 76.15,92.71 74.88,91.44 | 74.88,91.44 74.88,92.76 | 74.88,92.76 74.88,101.65 68.58,107.95 JP1.4 | 74.88,91.44 U1.32 74.88,84.19 | 78.74,76.25 U1.48 73.61,76.25 72.39,77.47 72.39,81.28 | 78.74,76.25 81.28,76.25 | 81.28,76.25 85.04,76.25 v85.09,76.2 | v91.44,71.12 IC1.16 | 44.45,54.61 v44.45,25.4 | 21.59,115.57 19.05,113.03 JP3.3 | 21.59,115.57 44.45,115.57 55.88,104.14 63.5,104.14 74.88,92.76 | JP2.3 11.43,107.95 12.7,109.22 12.7,113.03 15.24,115.57 21.59,115.57 | U1.1 65.46,76.2 | 44.45,55.88 31.75,43.18 JP4.2 | U1.1 65.56,76.2 | 67.59,82.27 U1.13 63.5,82.27 | 67.59,82.27 68.58,81.28
  Bottom 0.254: 68.58,81.28 68.58,77.47 67.36,76.25 | 72.39,81.28 74.93,83.82 74.88,83.87 74.88,84.19 | 72.39,81.28 68.58,81.28 | U1.64 67.36,76.25 | U1.1 67.36,76.25 | v55.88,20.32 54.61,20.32 52.07,17.78 | v68.58,20.32 67.31,20.32 64.77,17.78 | v82.55,20.32 81.28,20.32 78.74,17.78 | v96.52,20.32 95.25,20.32 92.71,17.78 | v110.49,20.32 109.22,20.32 106.68,17.78 | v124.46,20.32 123.19,20.32 120.65,17.78 | 92.71,17.78 106.68,17.78 | v138.43,20.32 137.16,20.32 134.62,17.78 | 81.28,76.25 82.55,77.52 C7.1 | C3.1 77.26,85.3 | 75.99,85.3 74.88,84.19 | 77.26,85.3 78.95,85.3 C12.1 C4.1 C11.1 | 78.74,76.25 80.06,74.93 C5.1 | U1.19 68.38,83.82 | 68.38,83.82 68.38,83.06 67.59,82.27 | 75.99,85.3 77.26,85.3 | C6.1 76.71,86.02 75.99,85.3 | C9.1 76.62,75.83 76.21,76.24 76.2,76.24 | U1.1 63.13,76.25 C18.2 | U1.1 66.04,76.25 64.3,74.51 C17.2 | 66.09,73.66 C8.1 66.04,73.61 67.35,74.92 67.35,74.93 | 63.5,82.27 63.36,82.27 C1.1 | C2.1 63.5,82.27 | C10.1 67.09,83.82 68.38,83.82